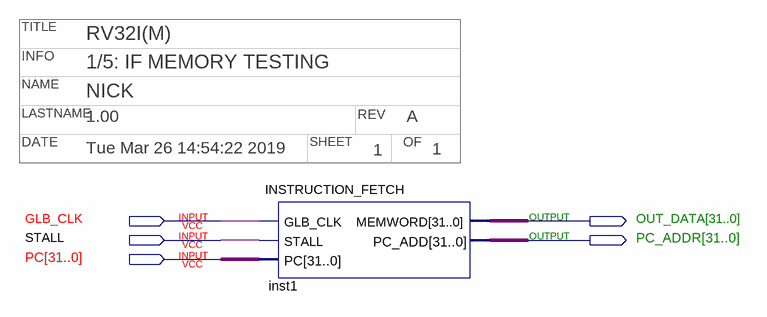
[diagram p0: schematic sheet]
// Quartus schematic I_F_MEMTEST.bdf as structural Verilog: 1 symbols, 5 pins
// Title block: TITLE: RV32I(M); INFO: 1/5: IF MEMORY TESTING; NAME: NICK; LASTNAME: 1.00; REV: A; DATE: Tue Mar 26 14:54:22 2019; SHEET: 1; OF: 1
module I_F_MEMTEST (
  input  GLB_CLK,
  input  STALL,
  input  [31:0] PC,
  output [31:0] OUT_DATA,
  output [31:0] PC_ADDR
);

  INSTRUCTION_FETCH inst1 (.GLB_CLK(GLB_CLK), .STALL(STALL), .PC(PC), .MEMWORD(OUT_DATA), .PC_ADD(PC_ADDR));
endmodule
